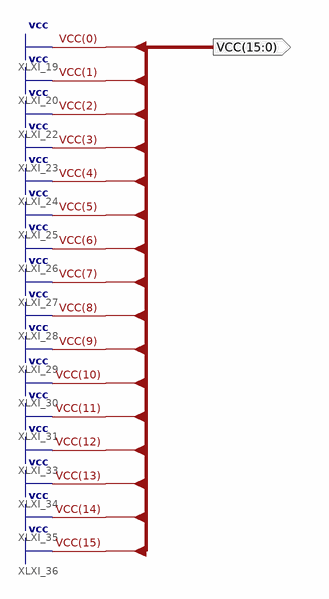
[diagram p0: schematic sheet 1]
// Xilinx ISE schematic vcc16.sch (spartan6) as structural Verilog: 0 symbols, 1 ports
module vcc16 (
  output [15:0] VCC
);


  assign VCC = {16{1'b1}};
endmodule
